# Altium schematic sheet Schemat.SchDoc
size A3; SheetNumber: 1; SheetTotal: 1
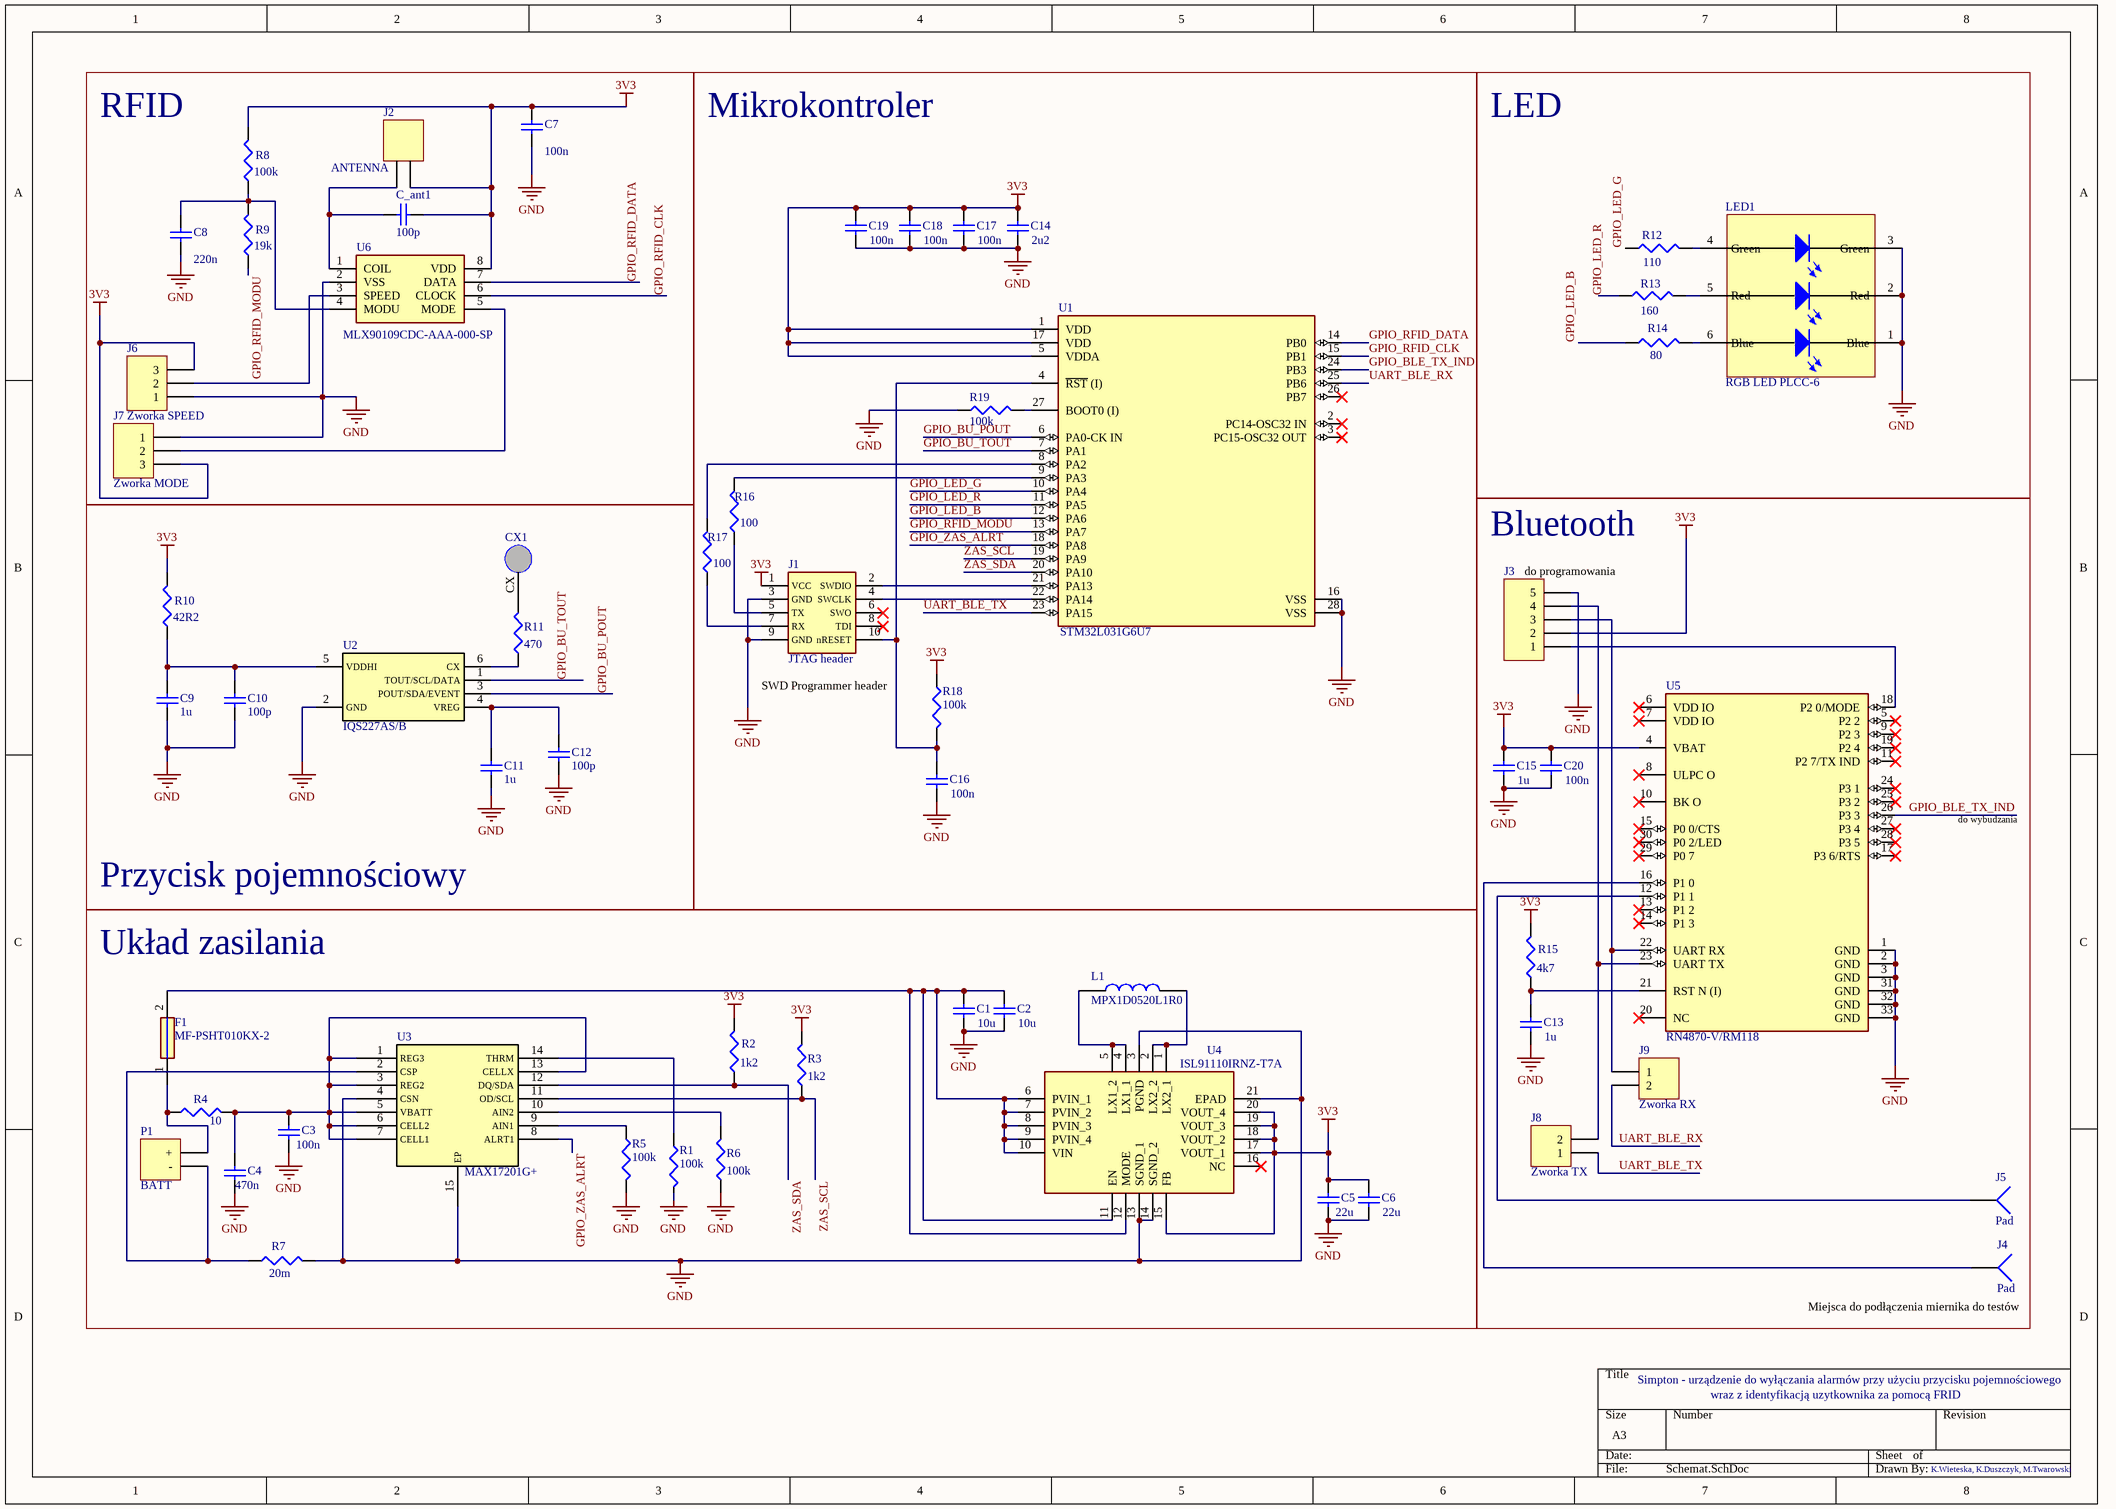
[diagram p0: Schemat.SchDoc]

## Parts
C1  value 10u  [1608[0603]]  (hidden comment: Cap Semi)
C2  value 10u  [1608[0603]]  (hidden comment: Cap Semi)
C3  value 100n  [0402]  (hidden comment: Cap Semi)
C4  value 470n  [0402]  (hidden comment: Cap Semi)
C5  value 22u  [1608[0603]]  (hidden comment: Cap Semi)
C6  value 22u  [1608[0603]]  (hidden comment: Cap Semi)
C7  value 100n  [0402]  (hidden comment: Cap Semi)
C8  value 220n  [0402]  (hidden comment: Cap Semi)
C9  value 1u  [0402]  (hidden comment: Cap Semi)
C10  value 100p  [0402]  (hidden comment: Cap Semi)
C11  value 1u  [0402]  (hidden comment: Cap Semi)
C12  value 100p  [0402]  (hidden comment: Cap Semi)
C13  value 1u  [0402]  (hidden comment: Cap Semi)
C14  value 2u2  [0402]  (hidden comment: Cap Semi)
C15  value 1u  [0402]  (hidden comment: Cap Semi)
C16  value 100n  [0402]  (hidden comment: Cap Semi)
C17  value 100n  [0402]  (hidden comment: Cap Semi)
C18  value 100n  [0402]  (hidden comment: Cap Semi)
C19  value 100n  [0402]  (hidden comment: Cap Semi)
C20  value 100n  [0402]  (hidden comment: Cap Semi)
C_ant1  value 100p  [C1206]  (hidden comment: Cap Semi)
CX1  KD_electrode  [KD_electrode]  (value not drawn)
F1  MF-PSHT010KX-2  [FUSC2214X120N]
J1  JTAG header  [KD_JTAG_header]
J2  ANTENNA  [HDR1X2]
J3  Header 5  [HDR1X5]  (value not drawn)
J4  Pad  [PIN1]
J5  Pad  [PIN1]
J6  Zworka SPEED  [HDR1X3]
J7  Zworka MODE  [HDR1X3]
J8  Zworka TX  [HDR1X2]
J9  Zworka RX  [HDR1X2]
L1  MPX1D0520L1R0  [INDPM5350X200N]
LED1  RGB LED PLCC-6  [5050]
P1  BATT  [HDR1X2]
R1  value 100k  [J1-0603]  (hidden comment: Res3)
R2  value 1k2  [J1-0603]  (hidden comment: Res3)
R3  value 1k2  [J1-0603]  (hidden comment: Res3)
R4  value 10  [J1-0603]  (hidden comment: Res3)
R5  value 100k  [J1-0603]  (hidden comment: Res3)
R6  value 100k  [J1-0603]  (hidden comment: Res3)
R7  value 20m  [J1-0603]  (hidden comment: Res3)
R8  value 100k  [J1-0603]  (hidden comment: Res3)
R9  value 19k  [J1-0603]  (hidden comment: Res3)
R10  value 42R2  [J1-0603]  (hidden comment: Res3)
R11  value 470  [J1-0603]  (hidden comment: Res3)
R12  value 110  [J1-0603]  (hidden comment: Res3)
R13  value 160  [J1-0603]  (hidden comment: Res3)
R14  value 80  [J1-0603]  (hidden comment: Res3)
R15  value 4k7  [J1-0603]  (hidden comment: Res3)
R16  value 100  [J1-0603]  (hidden comment: Res3)
R17  value 100  [J1-0603]  (hidden comment: Res3)
R18  value 100k  [J1-0603]  (hidden comment: Res3)
R19  value 100k  [J1-0603]  (hidden comment: Res3)
U1  STM32L031G6U7  [FP-UFQFPN28-A0B0-MFG]
U2  IQS227AS/B  [KD_TSOT23-6]
U3  MAX17201G+  [KW_TDFN14]
U4  ISL91110IRNZ-T7A  [QFN50P400X400X100-21N]
U5  RN4870-V/RM118  [FP-RN4870-V-RM118-MFG]
U6  MLX90109CDC-AAA-000-SP  [SOIC127P600X172-8N]

## Blocks framed on the sheet
RFID: C7 C8 C_ant1 J2 J6 J7 R8 R9 U6
Mikrokontroler: C14 C16-C19 J1 R16-R19 U1
LED: LED1 R12-R14
Bluetooth: C13 C15 C20 J3-J5 J8 J9 R15 U5
Przycisk pojemnościowy: C9-C12 CX1 R10 R11 U2
Układ zasilania: C1-C6 F1 L1 P1 R1-R7 U3 U4

## Nets
3V3: C5.1 C6.1 C7.2 C14.1 C15.1 C17.1 C18.1 C19.1 C20.1 C_ant1.1 J1.1(VCC) J2.2(+) J3.2 J6.3 J7.3 R2.2 R3.2 R8.2 R10.2 R15.2 R18.1 U1.1(VDD) U1.5(VDDA) U1.17(VDD) U4.15(FB) U4.17(VOUT_1) U4.18(VOUT_2) U4.19(VOUT_3) U4.20(VOUT_4) U5.4(VBAT) U6.8(VDD)
GND: C1.2 C2.2 C3.2 C4.2 C5.2 C6.2 C7.1 C8.1 C9.2 C10.2 C11.2 C12.2 C13.2 C14.2 C15.2 C16.2 C17.2 C18.2 C19.2 C20.2 J1.3(GND) J1.9(GND) J3.5 J6.1 J7.1 LED1.1(Blue) LED1.2(Red) LED1.3(Green) R1.2 R5.2 R6.1 R7.2 R19.1 U1.16(VSS) U1.28(VSS) U2.2(GND) U3.4(CSN) U3.15(EP) U4.3(PGND) U4.13(SGND_1) U4.14(SGND_2) U4.21(EPAD) U5.1(GND) U5.2(GND) U5.3(GND) U5.31(GND) U5.32(GND) U5.33(GND) U6.2(VSS)
GPIO_BLE_TX_IND: U1.24(PB3) U5.26(P3_3)
GPIO_BU_POUT: U1.6(PA0-CK_IN) U2.3(POUT/SDA/EVENT)
GPIO_BU_TOUT: U1.7(PA1) U2.1(TOUT/SCL/DATA)
GPIO_LED_B: R14.1 U1.12(PA6)
GPIO_LED_G: R12.1 U1.10(PA4)
GPIO_LED_R: R13.1 U1.11(PA5)
GPIO_RFID_CLK: U1.15(PB1) U6.6(CLOCK)
GPIO_RFID_DATA: U1.14(PB0) U6.7(DATA)
GPIO_RFID_MODU: R9.1 U1.13(PA7)
GPIO_ZAS_ALRT: U1.18(PA8) U3.8(ALRT1)
UART_BLE_RX: J9.2 U1.25(PB6)
UART_BLE_TX: J8.1 U1.23(PA15)
ZAS_SCL: R3.1 U1.19(PA9) U3.11(OD/SCL)
ZAS_SDA: R2.1 U1.20(PA10) U3.12(DQ/SDA)
NetC1_1: C1.1 C2.1 F1.2 U4.6(PVIN_1) U4.7(PVIN_2) U4.8(PVIN_3) U4.9(PVIN_4) U4.10(VIN) U4.11(EN) U4.12(MODE)
NetC3_1: C3.1 C4.1 R4.2 U3.1(REG3) U3.3(REG2) U3.5(VBATT) U3.6(CELL2) U3.7(CELL1) U3.13(CELLX)
NetC8_2: C8.2 R8.1 R9.2 U6.4(MODU)
NetC9_1: C9.1 C10.1 R10.1 U2.5(VDDHI)
NetC11_1: C11.1 C12.1 U2.4(VREG)
NetC13_1: C13.1 R15.1 U5.21(RST_N_(I))
NetC16_1: C16.1 J1.10(nRESET) R18.2 U1.4(~{RST}_(I))
NetC_ant1_2: C_ant1.2 J2.1(-) U6.1(COIL)
NetCX1_CX: CX1.CX R11.2
NetF1_1: F1.1 P1.2(+) R4.1
NetJ1_2: J1.2(SWDIO) U1.21(PA13)
NetJ1_4: J1.4(SWCLK) U1.22(PA14)
NetJ1_5: J1.5(TX) R16.1
NetJ1_7: J1.7(RX) R17.1
NetJ3_1: J3.1 U5.18(P2_0/MODE)
NetJ3_3: J3.3 J9.1 U5.22(UART_RX)
NetJ3_4: J3.4 J8.2 U5.23(UART_TX)
NetJ4_1: J4.1 U5.16(P1_0)
NetJ5_1: J5.1 U5.12(P1_1)
NetJ6_2: J6.2 U6.3(SPEED)
NetJ7_2: J7.2 U6.5(MODE)
NetL1_1: L1.1 U4.1(LX2_1) U4.2(LX2_2)
NetL1_2: L1.2 U4.4(LX1_1) U4.5(LX1_2)
NetLED1_4: LED1.4(Green) R12.2
NetLED1_5: LED1.5(Red) R13.2
NetLED1_6: LED1.6(Blue) R14.2
NetP1_1: P1.1(-) R7.1 U3.2(CSP)
NetR1_1: R1.1 U3.14(THRM)
NetR5_1: R5.1 U3.9(AIN1)
NetR6_2: R6.2 U3.10(AIN2)
NetR11_1: R11.1 U2.6(CX)
NetR16_2: R16.2 U1.9(PA3)
NetR17_2: R17.2 U1.8(PA2)
NetR19_2: R19.2 U1.27(BOOT0_(I))

Not connected (* = marked no-connect by the designer): J1 6(SWO)* 8(TDI)*; U1 2(PC14-OSC32_IN)* 3(PC15-OSC32_OUT)* 26(PB7)*; U4 16(NC)*; U5 5(P2_2)* 6(VDD_IO)* 7(VDD_IO)* 8(ULPC_O)* 9(P2_3)* 10(BK_O)* 11(P2_7/TX_IND)* 13(P1_2)* 14(P1_3)* 15(P0_0/CTS)* 17(P3_6/RTS)* 19(P2_4)* 20(NC)* 24(P3_1)* 25(P3_2)* 27(P3_4)* 28(P3_5)* 29(P0_7)* 30(P0_2/LED)*

## Notes on the sheet
- (near J3) do programowania
- SWD Programmer header
- do wybudzania
- (near J4) Miejsca do podłączenia miernika do testów
- wraz z identyfikacją uzytkownika za pomocą FRID
- Simpton - urządzenie do wyłączania alarmów przy użyciu przycisku pojemnościowego
- K.Wieteska, K.Duszczyk, M.Twarowski

## Library data of the parts
C1-C20 C_ant1 = Cap Semi: Capacitor (Semiconductor SIM Model); Published: 8-Jun-2000; LatestRevisionDate: 29-May-2009; LatestRevisionNote: IPC-7351 Footprint Added.; PackageReference: C1206; Publisher: Altium Limited; PackageDescription: Chip Capacitor
F1 = MF-PSHT010KX-2: Fuse; Manufacturer_Name: Bourns; Manufacturer_Part_Number: MF-PSHT050KX-2; Datasheet Link: https://www.bourns.com/docs/product-datasheets/mfpsht.pdf; Height: 1.2mm; Mouser Part Number: 652-MF-PSHT050KX-2; Mouser Price/Stock: https://www.mouser.co.uk/ProductDetail/Bourns/MF-PSHT050KX-2?qs=XeJtXLiO41SgKAEP4Z5Pjw%3D%3D; Arrow Part Number: MF-PSHT050KX-2; Arrow Price/Stock: https://www.arrow.com/en/products/mf-psht050kx-2/bourns?region=nac
J1 = KD_JTAG_connector: Connector
J2 J8 J9 P1 = Header 2: Header, 2-Pin; LatestRevisionDate: 17-Jul-2002; LatestRevisionNote: Re-released for DXP Platform.; Publisher: Altium Limited
J3 = Header 5: Header, 5-Pin; LatestRevisionDate: 17-Jul-2002; LatestRevisionNote: Re-released for DXP Platform.; Publisher: Altium Limited
J4 J5 = Socket: LatestRevisionDate: 17-Jul-2002; LatestRevisionNote: Re-released for DXP Platform.; Publisher: Altium Limited
J6 J7 = Header 3: Header, 3-Pin; LatestRevisionDate: 17-Jul-2002; LatestRevisionNote: Re-released for DXP Platform.; Publisher: Altium Limited
L1 = KD_cewka
LED1 = KD_PLCC-6
R1-R19 = Res3: Resistor; Published: 8-Jun-2000; LatestRevisionDate: 29-May-2009; LatestRevisionNote: IPC-7351 Footprint Added.; PackageReference: J1-0603; Publisher: Altium Limited; PackageDescription: Chip Resistor
U1 = CMP-12105-000084-1: IC MCU 32BIT 32KB FLASH 28UFQFPN; Oscillator Type: Internal; Core Architecture: ARM; Peripherals: Brown-out Detect/Reset; Interface: I2C; Watchdog Timer: Yes; Max Power Dissipation: 167mW; Max Frequency: 32MHz; Operating Supply Voltage: 3.3V; Number of Timers/Counters: 4; Max Supply Voltage: 3.6V; RAM Size: 1KB; Number of Programmable I/O: 21; Min Supply Voltage: 1.8V; Lead Free: Lead Free; Mount: Surface Mount; Min Operating Temperature: -40°C; Frequency: 32MHz; Max Operating Temperature: 105°C; Number of Pins: 28; Memory Type: FLASH; Number of I/Os: 21; Memory Size: 32KB
U2 = KD_IQS227AS/B
U4 = ISL91110IRNZ-T7A: LED; Manufacturer_Name: Renesas Electronics; Datasheet Link: https://datasheet.datasheetarchive.com/originals/distributors/Datasheets_SAMA/d3e5c1b0a1d99c18e56c54f82b79d217.pdf; Height: 1mm; Manufacturer_Part_Number: ISL91110IRNZ-T7A; Mouser Part Number: 968-ISL91110IRNZ-T7A; Mouser Price/Stock: https://www.mouser.co.uk/ProductDetail/Renesas-Intersil/ISL91110IRNZ-T7A?qs=vyIerDHf%2Fmmihws9YL5pdg%3D%3D
U5 = CMP-06331-000050-1: RX TXRX MOD BLE 5.0 CHIP SMD; Max Supply Voltage: 3.6V; Min Supply Voltage: 1.9V; Lead Free: Lead Free; Case/Package: Module; REACH SVHC: No SVHC; RoHS Compliant: No; Max Operating Temperature: 70°C; Min Operating Temperature: -20°C
U6 = MLX90109CDC-AAA-000-SP: Hardware; Manufacturer_Name: Melexis; Datasheet Link: https://www.melexis.com/-/media/files/documents/datasheets/mlx90109-datasheet-melexis.pdf; Height: 1.72mm; Manufacturer_Part_Number: MLX90109CDC-AAA-000-SP; Mouser Part Number: 482-90109CDCAAA000SP; Mouser Price/Stock: https://www.mouser.co.uk/ProductDetail/Melexis/MLX90109CDC-AAA-000-SP?qs=KuGPmAKtFKVJWBIJMV%252B4%252Bg%3D%3D